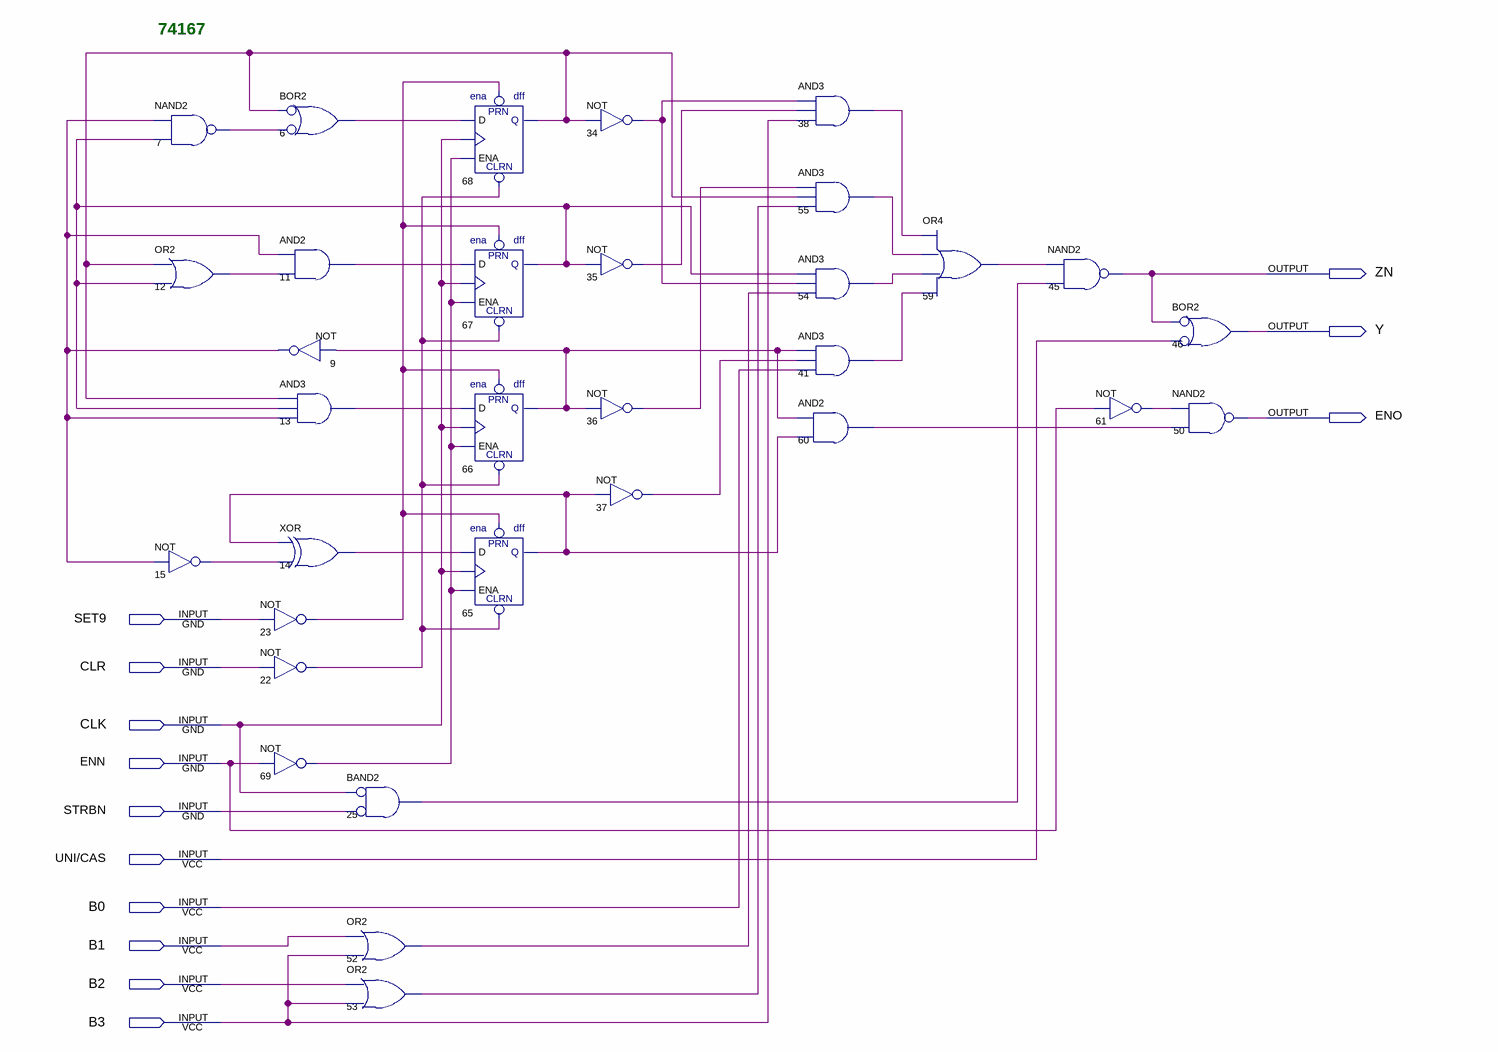
[diagram p0: schematic sheet]
// Quartus schematic 74167.bdf as structural Verilog: 32 symbols, 13 pins
module \74167  (
  input  SET9,
  input  CLR,
  input  CLK,
  input  ENN,
  input  STRBN,
  input  \UNI/CAS ,
  input  B0,
  input  B1,
  input  B2,
  input  B3,
  output ZN,
  output Y,
  output ENO
);

  wire n6_out, n7_out, n9_out, n11_out, n12_out, n13_out, n14_out, n15_out, n22_out, n23_out, n25_out,
       n34_out, n35_out, n36_out, n37_out, n38_out, n41_out, n52_out, n53_out, n54_out, n55_out, n59_out,
       n60_out, n61_out, n65_q, n66_q, n67_q, n68_q, n69_out;

  nand u_7 (n7_out, n9_out, n67_q);
  or u_12 (n12_out, n68_q, n67_q);
  not u_15 (n15_out, n9_out);
  or u_6 (n6_out, ~n68_q, ~n7_out);  // BOR2
  and u_11 (n11_out, n9_out, n12_out);
  not u_9 (n9_out, n66_q);
  and u_13 (n13_out, n68_q, n67_q, n9_out);
  xor u_14 (n14_out, n65_q, n15_out);
  not u_23 (n23_out, SET9);
  not u_22 (n22_out, CLR);
  not u_69 (n69_out, ENN);
  and u_25 (n25_out, ~CLK, ~STRBN);  // BAND2
  or u_52 (n52_out, B1, B3);
  or u_53 (n53_out, B2, B3);
  enadff u_68 (.ENA(n69_out), .D(n6_out), .PRN(n23_out), .CLRN(n22_out), .CLK(CLK), .Q(n68_q));
  enadff u_67 (.ENA(n69_out), .D(n11_out), .PRN(n23_out), .CLRN(n22_out), .CLK(CLK), .Q(n67_q));
  enadff u_66 (.ENA(n69_out), .D(n13_out), .PRN(n23_out), .CLRN(n22_out), .CLK(CLK), .Q(n66_q));
  enadff u_65 (.ENA(n69_out), .D(n14_out), .PRN(n23_out), .CLRN(n22_out), .CLK(CLK), .Q(n65_q));
  not u_34 (n34_out, n68_q);
  not u_35 (n35_out, n67_q);
  not u_36 (n36_out, n66_q);
  not u_37 (n37_out, n65_q);
  and u_38 (n38_out, n34_out, n35_out, B3);
  and u_55 (n55_out, n36_out, n68_q, n53_out);
  and u_54 (n54_out, n67_q, n34_out, n52_out);
  and u_41 (n41_out, n66_q, n37_out, B0);
  and u_60 (n60_out, n66_q, n65_q);
  or u_59 (n59_out, n38_out, n55_out, n54_out, n41_out);
  nand u_45 (ZN, n59_out, n25_out);
  not u_61 (n61_out, ENN);
  or u_46 (Y, ~ZN, ~\UNI/CAS );  // BOR2
  nand u_50 (ENO, n61_out, n60_out);

  // Notes on the sheet:
  //   74167
endmodule
